# Altium schematic sheet RP2040.SchDoc
size A3; SheetNumber: 1; SheetTotal: 3
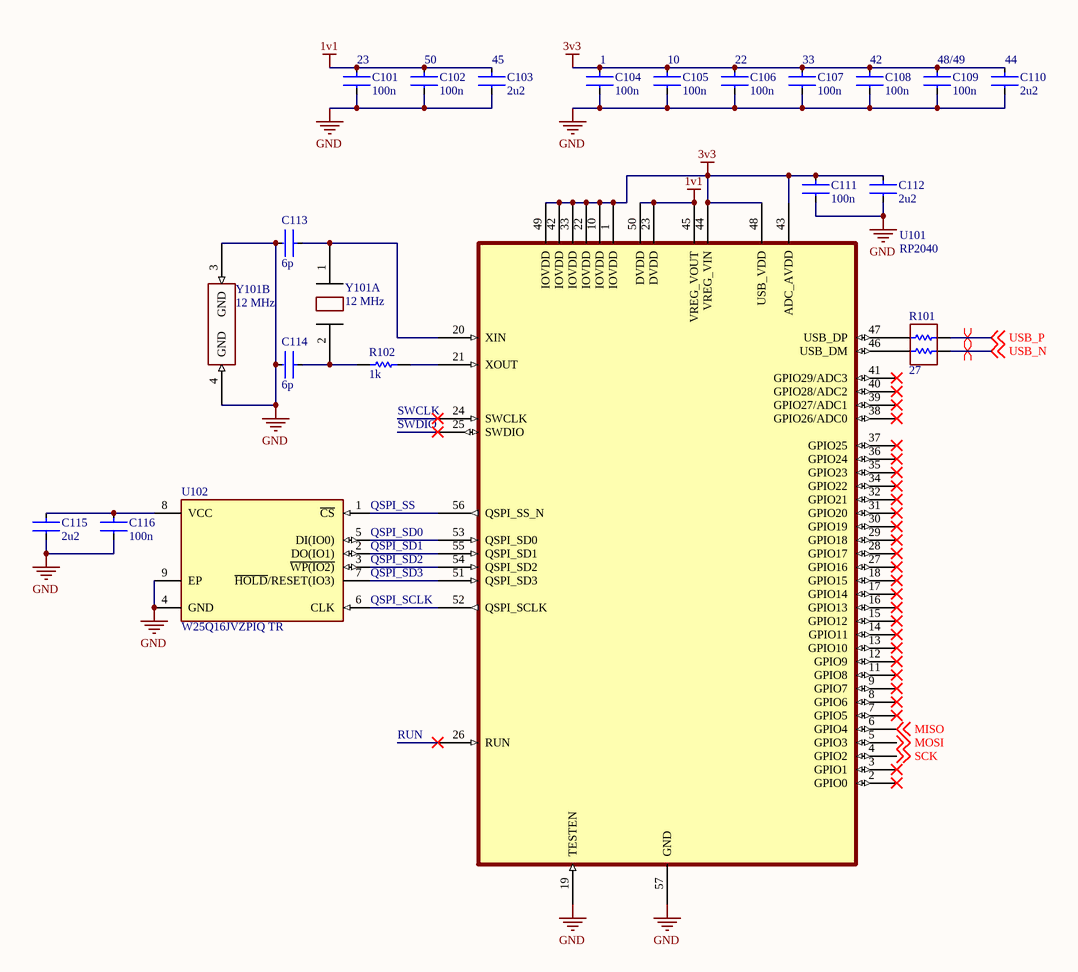
[diagram p0: RP2040.SchDoc]

## Parts
C101  100n  [FP-GCM155-0_05-MFG]
C102  100n  [FP-GCM155-0_05-MFG]
C103  2u2  [CAPC1608X10N]
C104  100n  [FP-GCM155-0_05-MFG]
C105  100n  [FP-GCM155-0_05-MFG]
C106  100n  [FP-GCM155-0_05-MFG]
C107  100n  [FP-GCM155-0_05-MFG]
C108  100n  [FP-GCM155-0_05-MFG]
C109  100n  [FP-GCM155-0_05-MFG]
C110  2u2  [CAPC1608X10N]
C111  100n  [FP-GCM155-0_05-MFG]
C112  2u2  [CAPC1608X10N]
C113  6p  [FP-GCQ155-0_05-MFG]
C114  6p  [FP-GCQ155-0_05-MFG]
C115  2u2  [CAPC1608X10N]
C116  100n  [FP-GCM155-0_05-MFG]
R101  27  [CAC-65P100X100-4L]
R102  1k  [RESC1005X04N]
U101  RP2040  [QFN40P700X700X90_HS-57N]
U102  W25Q16JVZPIQ TR  [WSON-8]
Y101  12 MHz  (parts A,B of 2)

## Nets
1v1: C101.1 C102.1 C103.1 U101.23(DVDD) U101.45(VREG_VOUT) U101.50(DVDD)
3v3: C104.1 C105.1 C106.1 C107.1 C108.1 C109.1 C110.1 C111.1 C112.1 U101.1(IOVDD) U101.10(IOVDD) U101.22(IOVDD) U101.33(IOVDD) U101.42(IOVDD) U101.43(ADC_AVDD) U101.44(VREG_VIN) U101.48(USB_VDD) U101.49(IOVDD)
GND: C101.2 C102.2 C103.2 C104.2 C105.2 C106.2 C107.2 C108.2 C109.2 C110.2 C111.2 C112.2 C113.2 C114.2 C115.2 C116.2 U101.19(TESTEN) U101.57(GND) U102.4(GND) U102.9(EP) Y101.3(GND) Y101.4(GND)
MISO: U101.6(GPIO4) ; off-sheet MISO
MOSI: U101.5(GPIO3) ; off-sheet MOSI
SCK: U101.4(GPIO2) ; off-sheet SCK
USB_N: R101.3 ; off-sheet USB_N
USB_P: R101.4 ; off-sheet USB_P
NetC113_1: C113.1 U101.20(XIN) Y101.1
NetC114_1: C114.1 R102.1 Y101.2
NetC115_1: C115.1 C116.1 U102.8(VCC)
NetR101_1: R101.1 U101.47(USB_DP)
NetR101_2: R101.2 U101.46(USB_DM)
NetR102_2: R102.2 U101.21(XOUT)
NetU101_51: U101.51(QSPI_SD3) U102.7(~{HOLD}/RESET(IO3))
NetU101_52: U101.52(QSPI_SCLK) U102.6(CLK)
NetU101_53: U101.53(QSPI_SD0) U102.5(DI(IO0))
NetU101_54: U101.54(QSPI_SD2) U102.3(~{WP(IO2)})
NetU101_55: U101.55(QSPI_SD1) U102.2(DO(IO1))
NetU101_56: U101.56(QSPI_SS_N) U102.1(~{CS})

Not connected (* = marked no-connect by the designer): U101 2(GPIO0)* 3(GPIO1)* 7(GPIO5)* 8(GPIO6)* 9(GPIO7)* 11(GPIO8)* 12(GPIO9)* 13(GPIO10)* 14(GPIO11)* 15(GPIO12)* 16(GPIO13)* 17(GPIO14)* 18(GPIO15)* 24(SWCLK)* 25(SWDIO)* 26(RUN)* 27(GPIO16)* 28(GPIO17)* 29(GPIO18)* 30(GPIO19)* 31(GPIO20)* 32(GPIO21)* 34(GPIO22)* 35(GPIO23)* 36(GPIO24)* 37(GPIO25)* 38(GPIO26/ADC0)* 39(GPIO27/ADC1)* 40(GPIO28/ADC2)* 41(GPIO29/ADC3)*

## Layout directives
differential pair: USB_N, USB_P

## Notes on the sheet
- (near C101) 23
- (near C102) 50
- (near C103) 45
- (near C104) 1
- (near C105) 10
- (near C106) 22
- (near C107) 33
- (near C108) 42
- (near C109) 48/49
- (near C110) 44
- SWCLK
- SWDIO
- (near U102) QSPI_SS
- (near U102) QSPI_SD0
- (near U102) QSPI_SD1
- (near U102) QSPI_SD2
- (near U102) QSPI_SD3
- (near U102) QSPI_SCLK
- RUN

## Library data of the parts
C101 C102 C104-C109 C111 C116 = GCM155R71H104KE02J: Ceramic Capacitor for Automotive 100nF ±10% 50VDC X7R 0402 Paper T/R; Voltage Rating (DC): 50V; Case Code (Metric): 1005; Dielectric: X7R; Capacitance: 100nF; Packaging: Tape and Reel; Min Operating Temperature: -55°C; Length: 0.039inch; Thickness: 0.022inch; Height: 0.5mm; Mount: Surface Mount; Termination: SMD/SMT; Voltage Rating: 50V; Package Quantity: 50000; Width: 0.02inch; Case/Package: 0402; Case Code (Imperial): 0402; Ratings: AEC-Q200; Max Operating Temperature: 125°C; Tolerance: 10%; Weight: 0.000212oz; Supplier 1: Digi-Key; Supplier Part Number 1: 490-14514-1-ND
C103 C110 C112 C115 = GRT188R61H225ME13D: Multilayer Ceramic Capacitors MLCC - SMD/SMT 0603 50Vdc 2.2uF X5R 20%; Supplier 1: Future Electronics; Supplier Part Number 1: 5087209
C113 C114 = GCQ1555C1H6R0BB01D: High Q Ceramic Capacitor for Automotive 6pF ±0.1pF 50VDC C0G 0402 Paper T/R; Voltage Rating: 50V; Max Operating Temperature: 125°C; Capacitance: 6pF; Case Code (Imperial): 0402; Min Operating Temperature: -55°C; Case/Package: 0402; Mount: Surface Mount; Case Code (Metric): 1005; Ratings: AEC-Q200; Packaging: Tape and Reel; Supplier 1: Digi-Key; Supplier Part Number 1: 490-17493-1-ND
R101 = EXB-24V270JX: Supplier 1: Digi-Key; Supplier Part Number 1: Y5270CT-ND
R102 = ERJ-2GEJ102X: Manufacturer: Panasonic; Part Number: ERJ-2GEJ102X; Supplier 1: Newark; Supplier Part Number 1: 65T8247
U102 = W25Q16JVZPIQ TR: IC FLASH 16M SPI 133MHZ 8WSON; Memory Type: Non-Volatile; Memory Size: 16Mb; Max Operating Temperature: 85°C; Min Operating Temperature: -40°C; Frequency: 133MHz; Mount: Surface Mount; Packaging: Tape and Reel; Supplier 1: Digi-Key; Supplier Part Number 1: W25Q16JVZPIQCT-ND
Y101 = ABM10-166-12.000MHZ-T3: Supplier 1: Newark; Supplier Part Number 1: 51AC8104
U101 = RP2040: Supplier 1: Newark; Supplier Part Number 1: 49AJ8739